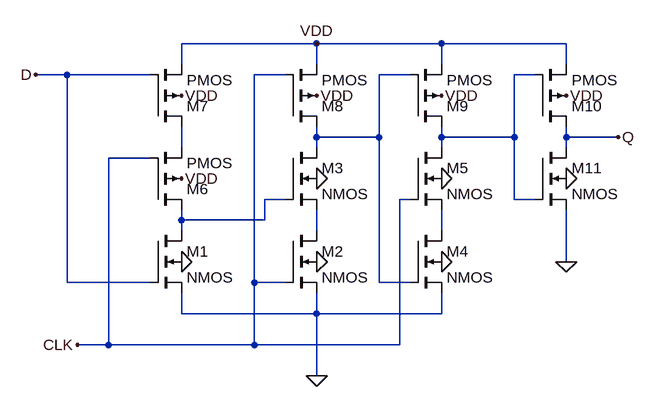
[diagram p0: schematic Draft1.asc]
Draft1.asc, the LTspice schematic file:
Version 4
SHEET 1 900 680
WIRE 400 -192 192 -192
WIRE 592 -192 400 -192
WIRE 784 -192 592 -192
WIRE 192 -160 192 -192
WIRE 400 -160 400 -192
WIRE 592 -160 592 -192
WIRE 784 -160 784 -192
WIRE 16 -144 -32 -144
WIRE 144 -144 16 -144
WIRE 352 -144 304 -144
WIRE 544 -144 496 -144
WIRE 736 -144 704 -144
WIRE 400 -48 400 -64
WIRE 496 -48 496 -144
WIRE 496 -48 400 -48
WIRE 592 -48 592 -64
WIRE 704 -48 704 -144
WIRE 704 -48 592 -48
WIRE 784 -48 784 -64
WIRE 864 -48 784 -48
WIRE 192 -32 192 -64
WIRE 400 -32 400 -48
WIRE 592 -32 592 -48
WIRE 784 -32 784 -48
WIRE 144 -16 80 -16
WIRE 352 48 320 48
WIRE 544 48 528 48
WIRE 704 48 704 -48
WIRE 736 48 704 48
WIRE 192 80 192 64
WIRE 320 80 320 48
WIRE 320 80 192 80
WIRE 192 96 192 80
WIRE 400 96 400 64
WIRE 592 96 592 64
WIRE 784 144 784 64
WIRE 16 176 16 -144
WIRE 144 176 16 176
WIRE 304 176 304 -144
WIRE 352 176 304 176
WIRE 496 176 496 -48
WIRE 544 176 496 176
WIRE 192 224 192 192
WIRE 400 224 400 192
WIRE 400 224 192 224
WIRE 592 224 592 192
WIRE 592 224 400 224
WIRE 80 272 80 -16
WIRE 80 272 32 272
WIRE 304 272 304 176
WIRE 304 272 80 272
WIRE 528 272 528 48
WIRE 528 272 304 272
WIRE 400 320 400 224
FLAG 400 -192 VDD
FLAG 32 272 CLK
FLAG 400 320 0
FLAG 784 144 0
FLAG -32 -144 D
FLAG 864 -48 Q
FLAG 192 144 0
FLAG 400 144 0
FLAG 592 144 0
FLAG 400 16 0
FLAG 592 16 0
FLAG 784 16 0
FLAG 192 -112 VDD
FLAG 400 -112 VDD
FLAG 592 -112 VDD
FLAG 784 -112 VDD
FLAG 192 16 VDD
SYMBOL nmos4 144 96 R0
SYMATTR InstName M1
SYMBOL nmos4 352 96 R0
SYMATTR InstName M2
SYMBOL nmos4 352 -32 R0
SYMATTR InstName M3
SYMBOL nmos4 544 96 R0
SYMATTR InstName M4
SYMBOL nmos4 544 -32 R0
SYMATTR InstName M5
SYMBOL pmos4 144 64 M180
SYMATTR InstName M6
SYMBOL pmos4 144 -64 M180
SYMATTR InstName M7
SYMBOL pmos4 352 -64 M180
SYMATTR InstName M8
SYMBOL pmos4 544 -64 M180
SYMATTR InstName M9
SYMBOL pmos4 736 -64 M180
SYMATTR InstName M10
SYMBOL nmos4 736 -32 R0
SYMATTR InstName M11

The netlist it stands for:
* Draft1.asc
M1 N004 D 0 0 NMOS
M2 N005 CLK 0 0 NMOS
M3 N001 N004 N005 0 NMOS
M4 N006 N001 0 0 NMOS
M5 N002 CLK N006 0 NMOS
M6 N004 CLK N003 VDD PMOS
M7 N003 D VDD VDD PMOS
M8 N001 CLK VDD VDD PMOS
M9 N002 N001 VDD VDD PMOS
M10 Q N002 VDD VDD PMOS
M11 Q N002 0 0 NMOS
.model NMOS NMOS
.model PMOS PMOS
.lib standard.mos
.backanno
.end